# Altium project Temperature Monitor & Display.PrjPcb
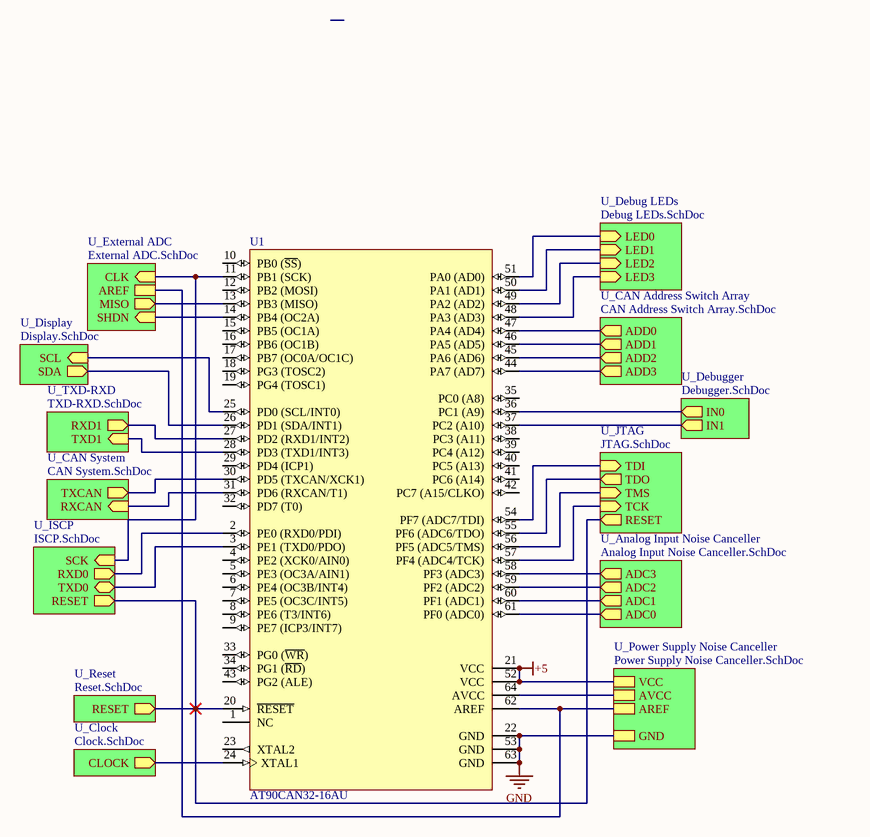
[diagram p0: Top Level.SchDoc]
14 sheets, 61 parts. Net scope: hierarchical (ports join the sheet entries above them; power ports are global).
Board file: Temperature Monitor & Display.PcbDoc
Sheets:
  Top Level.SchDoc
    U_Debug LEDs = Debug LEDs.SchDoc
    U_CAN Address Switch Array = CAN Address Switch Array.SchDoc
    U_JTAG = JTAG.SchDoc
    U_Power Supply Noise Canceller = Power Supply Noise Canceller.SchDoc
    U_Clock = Clock.SchDoc
    U_Reset = Reset.SchDoc
    U_CAN System = CAN System.SchDoc
    U_TXD-RXD = TXD-RXD.SchDoc
    U_ISCP = ISCP.SchDoc
    U_Analog Input Noise Canceller = Analog Input Noise Canceller.SchDoc
    U_Display = Display.SchDoc
    U_External ADC = External ADC.SchDoc
    U_Debugger = Debugger.SchDoc

## Sheet Top Level.SchDoc
size A

### Parts
U1  AT90CAN32-16AU  [64A_N]

### Sub-sheets
U_Analog Input Noise Canceller = Analog Input Noise Canceller.SchDoc: ADC0 (out), ADC1 (out), ADC2 (out), ADC3 (out)
U_CAN Address Switch Array = CAN Address Switch Array.SchDoc: ADD0 (out), ADD1 (out), ADD2 (out), ADD3 (out)
U_CAN System = CAN System.SchDoc: RXCAN (in), TXCAN (out)
U_Clock = Clock.SchDoc: CLOCK (out)
U_Debug LEDs = Debug LEDs.SchDoc: LED0 (in), LED1 (in), LED2 (in), LED3 (in)
U_Debugger = Debugger.SchDoc: IN0 (out), IN1 (out)
U_Display = Display.SchDoc: SCL (in), SDA (out)
U_External ADC = External ADC.SchDoc: AREF, CLK (in), SHDN (in), MISO (out)
U_ISCP = ISCP.SchDoc: SCK (in), TXD0 (bidir), RESET (out), RXD0 (out)
U_JTAG = JTAG.SchDoc: TDI (in), TDO (out), TCK (in), TMS (in), RESET (out)
U_Power Supply Noise Canceller = Power Supply Noise Canceller.SchDoc: VCC, AREF, GND, AVCC
U_Reset = Reset.SchDoc: RESET (out)
U_TXD-RXD = TXD-RXD.SchDoc: TXD1 (in), RXD1 (out)

### Nets
+5: U1.21(VCC) U1.52(VCC) ; sheet U_Power Supply Noise Canceller/VCC
GND: U1.22(GND) U1.53(GND) U1.63(GND) ; sheet U_Power Supply Noise Canceller/GND
NetC2_2: U1.62(AREF) ; sheet U_Power Supply Noise Canceller/AREF, sheet U_External ADC/AREF
NetC3_2: U1.64(AVCC) ; sheet U_Power Supply Noise Canceller/AVCC
NetC11_2: U1.61(PF0_(ADC0)) ; sheet U_Analog Input Noise Canceller/ADC0
NetC12_2: U1.60(PF1_(ADC1)) ; sheet U_Analog Input Noise Canceller/ADC1
NetC13_2: U1.59(PF2_(ADC2)) ; sheet U_Analog Input Noise Canceller/ADC2
NetC14_2: U1.58(PF3_(ADC3)) ; sheet U_Analog Input Noise Canceller/ADC3
NetCAN_2: U1.49(PA2_(AD2)) ; sheet U_Debug LEDs/LED2
NetDB_2: U1.50(PA1_(AD1)) ; sheet U_Debug LEDs/LED1
NetERR_2: U1.51(PA0_(AD0)) ; sheet U_Debug LEDs/LED0
NetJ2_1: U1.28(PD3_(TXD1/INT3)) ; sheet U_TXD-RXD/TXD1
NetJ2_2: U1.27(PD2_(RXD1/INT2)) ; sheet U_TXD-RXD/RXD1
NetJ3_1: U1.25(PD0_(SCL/INT0)) ; sheet U_Display/SCL
NetJ3_2: U1.26(PD1_(SDA/INT1)) ; sheet U_Display/SDA
NetP1_1: U1.57(PF4_(ADC4/TCK)) ; sheet U_JTAG/TCK
NetP1_3: U1.55(PF6_(ADC6/TDO)) ; sheet U_JTAG/TDO
NetP1_5: U1.56(PF5_(ADC5/TMS)) ; sheet U_JTAG/TMS
NetP1_6: U1.20(~{RESET}) ; sheet U_JTAG/RESET, sheet U_Reset/RESET, sheet U_ISCP/RESET
NetP1_9: U1.54(PF7_(ADC7/TDI)) ; sheet U_JTAG/TDI
NetP4_1: U1.2(PE0_(RXD0/PDI)) ; sheet U_ISCP/RXD0
NetP4_3: U1.11(PB1_(SCK)) ; sheet U_ISCP/SCK, sheet U_External ADC/CLK
NetP4_4: U1.3(PE1_(TXD0/PDO)) ; sheet U_ISCP/TXD0
NetPWR_2: U1.48(PA3_(AD3)) ; sheet U_Debug LEDs/LED3
NetR6_2: U1.47(PA4_(AD4)) ; sheet U_CAN Address Switch Array/ADD0
NetR7_2: U1.46(PA5_(AD5)) ; sheet U_CAN Address Switch Array/ADD1
NetR8_2: U1.45(PA6_(AD6)) ; sheet U_CAN Address Switch Array/ADD2
NetR9_2: U1.44(PA7_(AD7)) ; sheet U_CAN Address Switch Array/ADD3
NetR15_1: U1.36(PC1_(A9)) ; sheet U_Debugger/IN0
NetR16_2: U1.37(PC2_(A10)) ; sheet U_Debugger/IN1
NetU1_13: U1.13(PB3_(MISO)) ; sheet U_External ADC/MISO
NetU1_14: U1.14(PB4_(OC2A)) ; sheet U_External ADC/SHDN
NetU1_24: U1.24(XTAL1) ; sheet U_Clock/CLOCK
NetU1_30: U1.30(PD5_(TXCAN/XCK1)) ; sheet U_CAN System/TXCAN
NetU1_31: U1.31(PD6_(RXCAN/T1)) ; sheet U_CAN System/RXCAN

Not connected (* = marked no-connect by the designer): U1 1(NC) 4(PE2_(XCK0/AIN0)) 5(PE3_(OC3A/AIN1)) 6(PE4_(OC3B/INT4)) 7(PE5_(OC3C/INT5)) 8(PE6_(T3/INT6)) 9(PE7_(ICP3/INT7)) 10(PB0_(~{SS})) 12(PB2_(MOSI)) 15(PB5_(OC1A)) 16(PB6_(OC1B)) 17(PB7_(OC0A/OC1C)) 18(PG3_(TOSC2)) 19(PG4_(TOSC1)) 23(XTAL2) 29(PD4_(ICP1)) 32(PD7_(T0)) 33(PG0_(~{WR})) 34(PG1_(~{RD})) 35(PC0_(A8)) 38(PC3_(A11)) 39(PC4_(A12)) 40(PC5_(A13)) 41(PC6_(A14)) 42(PC7_(A15/CLKO)) 43(PG2_(ALE))

### Library data of the parts
U1 = CMP-0096-00116-2: 8-bit AVR Microcontroller, 32KB Flash and CAN Controller, 53 GPIO pins, Industrial Grade (-40° to +85°C), 64-pin LQFP, Green; RevisionNote: PackageVersion updated. URLs added.; DatasheetVersion: revH, Aug-2008; PackageReference: 64A; ComponentLink3URL: http://www.atmel.com/dyn/resources/prod_documents/7679S.pdf; ComponentLink3Description: AT90CAN32/64/128 Summary; ComponentLink2Description: AT90CAN32/64/128 Datasheet; ComponentLink2URL: http://www.atmel.com/dyn/resources/prod_documents/doc7679.pdf; ComponentLink1URL: http://www.atmel.com/; PackageVersion: revC, Oct-2010; PackageDescription: 64-Pin Plastic Thin Profile Quad Flat Pack, 14 x 14 x 1.0 mm Body, 0.8 mm Pitch (TQFP); Code_JEDEC: MS-026-AEB; ComponentLink1Description: Manufacturer URL

## Sheet Debug LEDs.SchDoc
size A
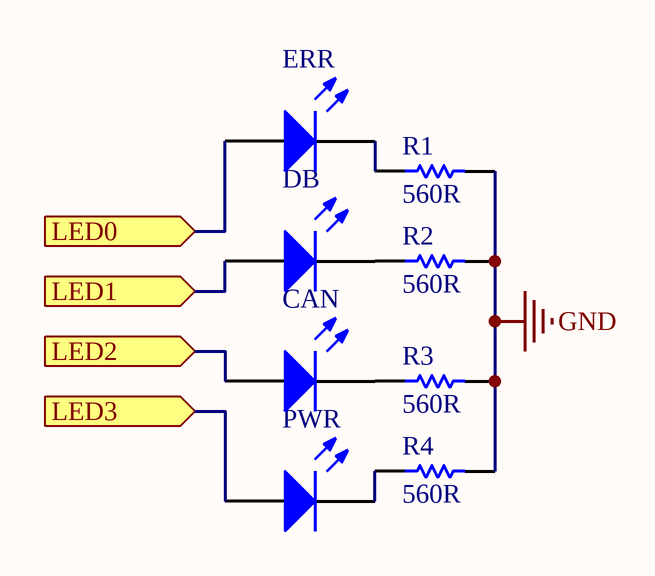
[diagram p1: Debug LEDs.SchDoc]

### Parts
CAN  150080BS75000  [0805_A]  (value not drawn)
DB  150080GS75000  [0805_A]  (value not drawn)
ERR  150080RS75000  [0805_A]  (value not drawn)
PWR  150080YS75000  [0805_A]  (value not drawn)
R1  560R  [RESC0805(2012)_M]
R2  560R  [RESC0805(2012)_M]
R3  560R  [RESC0805(2012)_M]
R4  560R  [RESC0805(2012)_M]

### Ports
LED0 (in), LED1 (in), LED2 (in), LED3 (in)

### Nets
GND: R1.2 R2.2 R3.2 R4.2
NetCAN_1: CAN.1(K) R3.1
NetCAN_2: CAN.2(A) ; port LED2
NetDB_1: DB.1(K) R2.1
NetDB_2: DB.2(A) ; port LED1
NetERR_1: ERR.1(K) R1.1
NetERR_2: ERR.2(A) ; port LED0
NetPWR_1: PWR.1(K) R4.1
NetPWR_2: PWR.2(A) ; port LED3

### Library data of the parts
CAN = CMP-1426-00008-1: SMD mono-color Chip LED, WL-SMCW, Blue; Manufacturer: Wuerth Elektronik; Color: Blue; ComponentLink2URL: http://katalog.we-online.com/led/datasheet/150080BS75000.pdf; ComponentLink1URL: http://www.we-online.com; ComponentLink2Description: Datasheet; PackageReference: 0805_A; ComponentLink1Description: Manufacturer URL; PartNumber: 150080BS75000
DB = CMP-1426-00007-1: SMD mono-color Chip LED, WL-SMCW, Green; Manufacturer: Wuerth Elektronik; PackageReference: 0805_A; Color: Green; PartNumber: 150080GS75000; ComponentLink2URL: http://katalog.we-online.com/led/datasheet/150080GS75000.pdf; ComponentLink1URL: http://www.we-online.com; ComponentLink1Description: Manufacturer URL; ComponentLink2Description: Datasheet
ERR = CMP-1426-00011-1: SMD mono-color Chip LED, WL-SMCW, Red; Manufacturer: Wuerth Elektronik; Color: Red; PartNumber: 150080RS75000; PackageReference: 0805_A; ComponentLink2Description: Datasheet; ComponentLink1URL: http://www.we-online.com; ComponentLink1Description: Manufacturer URL; ComponentLink2URL: http://katalog.we-online.com/led/datasheet/150080RS75000.pdf
PWR = CMP-1426-00012-1: SMD mono-color Chip LED, WL-SMCW, Yellow; Manufacturer: Wuerth Elektronik; Color: Yellow; ComponentLink1URL: http://www.we-online.com; PackageReference: 0805_A; ComponentLink2URL: http://katalog.we-online.com/led/datasheet/150080YS75000.pdf; ComponentLink1Description: Manufacturer URL; ComponentLink2Description: Datasheet; PartNumber: 150080YS75000
R1-R4 = CMP-1013-00482-1: 560R 0.125W 1% 0805 (2012 Metric)  SMD; Value: 560.00 Ohm; Case-Metric: 2012; Case-EIA: 0805; Technology: SMT; Tolerance: 1 %; Power: 0.125 W

## Sheet CAN Address Switch Array.SchDoc
size A
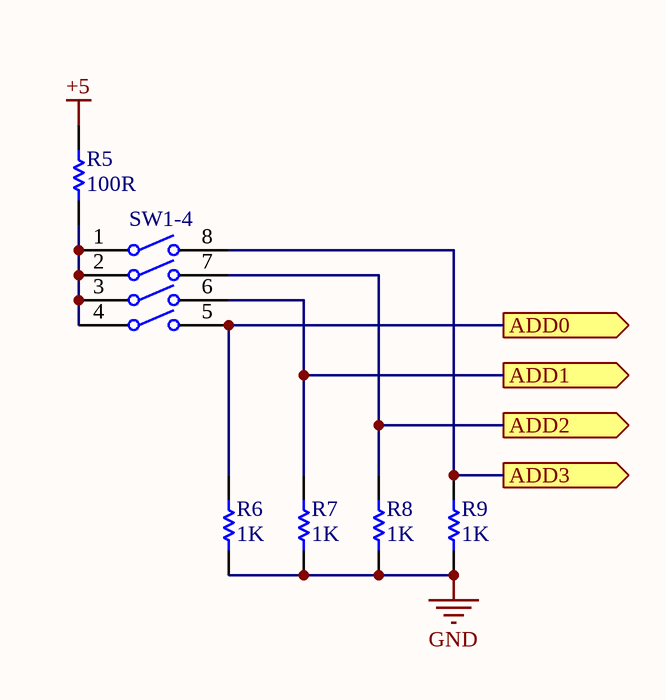
[diagram p2: CAN Address Switch Array.SchDoc]

### Parts
R5  100R  [RESC0805(2012)_L]
R6  1K  [RESC0805(2012)_M]
R7  1K  [RESC0805(2012)_M]
R8  1K  [RESC0805(2012)_M]
R9  1K  [RESC0805(2012)_M]
SW1-4  TDA04H0SB1  [CKCP-TDA04H0SB1R_V]  (value not drawn)

### Ports
ADD0 (out), ADD1 (out), ADD2 (out), ADD3 (out)

### Nets
+5: R5.2
GND: R6.1 R7.1 R8.1 R9.1
NetR5_1: R5.1 SW1-4.1 SW1-4.2 SW1-4.3 SW1-4.4
NetR6_2: R6.2 SW1-4.5 ; port ADD0
NetR7_2: R7.2 SW1-4.6 ; port ADD1
NetR8_2: R8.2 SW1-4.7 ; port ADD2
NetR9_2: R9.2 SW1-4.8 ; port ADD3

### Library data of the parts
R5 = CMP-1013-00397-1: 100R 0.125W 1% 0805 (2012 Metric)  SMD; Value: 100.00 Ohm; Case-Metric: 2012; Case-EIA: 0805; Technology: SMT; Power: 0.125 W; Tolerance: 1 %
R6-R9 = CMP-1013-00510-1: 1K 0.125W 1% 0805 (2012 Metric)  SMD; Case-Metric: 2012; Value: 1000.00 Ohm; Case-EIA: 0805; Tolerance: 1 %; Power: 0.125 W; Technology: SMT
SW1-4 = SMD Half-Pitch Dip Switch Array: Ultra-Miniature Surface Mount Half-Pitch DIP Switch, 25 mA, 24 V, -40 to 85 degC, 8-Pin SMD, RoHS, Tube; Contact Current Rating: 100 mA; Throw Configuration: SPST; Voltage Rating (DC): 24 V; Max Contact Resistance: 100 mohm; Max Current Rating: 25 mA; REACH SVHC: No SVHC; DatasheetVersion: 02/2016; Case\Package: DIP; Package Quantity: 70; Lead Pitch: 1.27 mm; Contact Plating: Gold; Packaging: Rail/Tube; Contact Finish: Gold; Mount: Surface Mount; Height: 2.3 mm; Contact Material: Copper; Max Operating Temperature: 85 degC; Max Voltage Rating (DC): 24 V; ComponentLink1URL: http://www.ck-components.com/media/1328/tda.pdf; PackageDescription: 8-Pin Surface Mount Device, Body 6.21 x 6.2 mm, Pitch 1.27 mm; Radiation Hardening: No; ComponentLink1Description: Datasheet; Current Rating: 100 mA; RoHSCompliant: true; PackageReference: TDA04H0SB1R; Min Operating Temperature: -40 degC; Pins: 4; Mounting Technology: Surface Mount; Length: 6.21 mm

## Sheet JTAG.SchDoc
size A
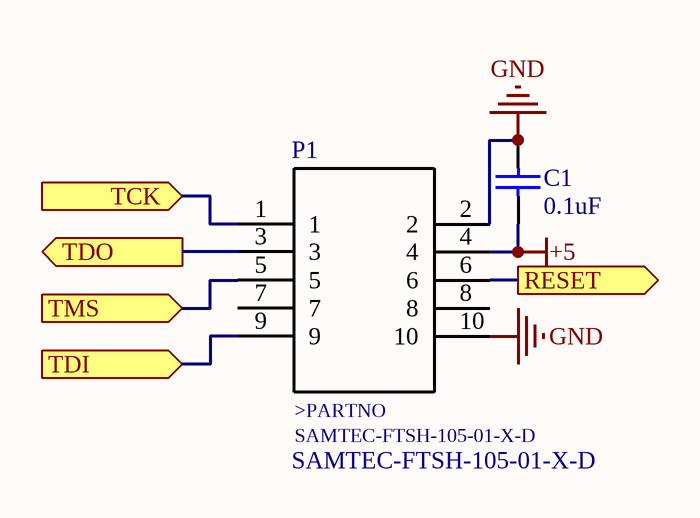
[diagram p3: JTAG.SchDoc]

### Parts
C1  0.1uF  [CAPC2013X94X50LL20T25]
P1  SAMTEC-FTSH-105-01-X-D  [SAMTEC-FTSH-105-01-X-D]

### Ports
RESET (out), TCK (in), TDI (in), TDO (out), TMS (in)

### Nets
+5: C1.1 P1.4
GND: C1.2 P1.2 P1.10
NetP1_1: P1.1 ; port TCK
NetP1_3: P1.3 ; port TDO
NetP1_5: P1.5 ; port TMS
NetP1_6: P1.6 ; port RESET
NetP1_9: P1.9 ; port TDI

Not connected (* = marked no-connect by the designer): P1 7 8

### Notes on the sheet
- (in symbol SAMTEC-FTSH-105-01-X-D) >PARTNO

### Library data of the parts
C1 = CMP-2000-05808-1: Chip Capacitor, 0.1 uF, +/- 5%, 50 V, -55 to 125 degC, 0805 (2012 Metric), RoHS, Tape and Reel; Case Width: 1.25mm; Case Length: 2.01mm; Case Height: 0.94mm; Brand: AVX; Type: StandardX7RMLCCs; Capacitance - nF: 100nF; Dissipation Factor DF: 2.5; Voltage Rating DC: 50V; Temperature Coefficient / Code: +/-15%; Capacitance - pF: 100000pF; Dielectric: X7R; Dimensions: 1.25mmWx2.01mmLx0.94mmH; Product: GeneralTypeMLCCs; Package Description: 2-Pin Surface Mount Device, Body 2.01 x 1.25 mm; Capacitance: 0.1uF; Package / Case: 0805(2012metric); Product Category: MultilayerCeramicCapacitorsMLCC-SMD/SMT; Case Code - mm: 2012; Packaging: Reel; Manufacturer URL: http://www.avx.com/; Operating Temperature Range: -55Cto+125C; Termination Style: SMD/SMT; Maximum Operating Temperature: +125C; Case Code - in: 0805; Minimum Operating Temperature: -55C; Factory Pack Quantity: 4000; RoHS: Details; Voltage Rating: 50V; Tolerance: 5%; Package Reference: 0805; Datasheet URL: http://www.farnell.com/datasheets/1679506.pdf; Manufacturer: AVX; Mounting Technology: SurfaceMount; Datasheet Version: 11/2012

## Sheet Power Supply Noise Canceller.SchDoc
size A
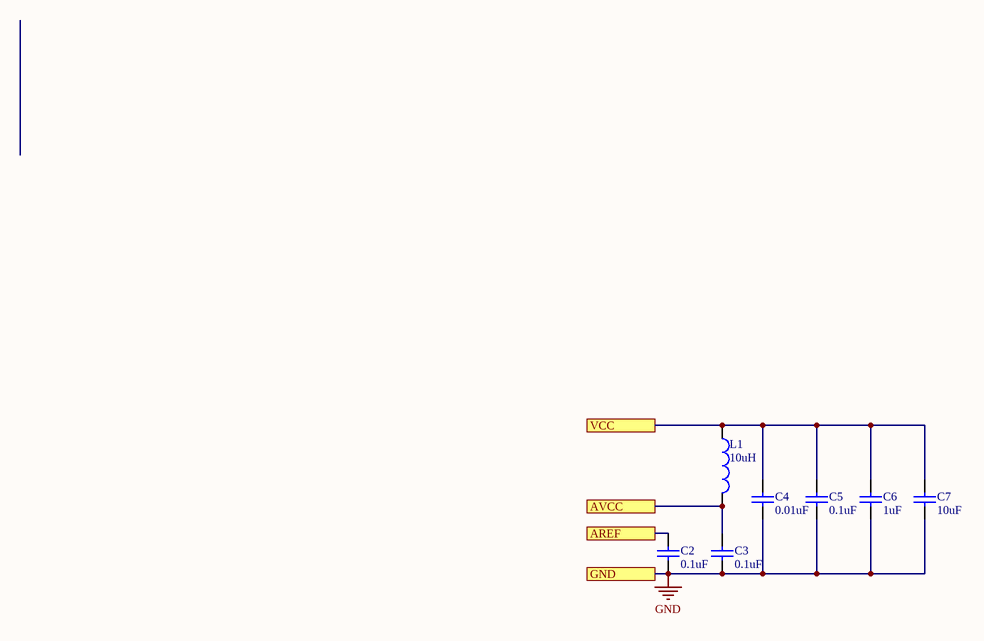
[diagram p4: Power Supply Noise Canceller.SchDoc]

### Parts
C2  0.1uF  [CAPC2013X94X50LL20T25]
C3  0.1uF  [CAPC2013X94X50LL20T25]
C4  0.01uF  [CAPC2013X88X50LL20T25]
C5  0.1uF  [CAPC2013X94X50LL20T25]
C6  1uF  [CAPC2013X145X50ML20T25]
C7  10uF  [CAPC2013X145X50LL20T20]
L1  10uH  [TDK-IND0805-125_V]

### Ports
AREF, AVCC, GND, VCC

### Nets
+5: C4.2 C5.2 C6.2 C7.2 L1.1 ; port VCC
GND: C2.1 C3.1 C4.1 C5.1 C6.1 C7.1 ; port GND
NetC2_2: C2.2 ; port AREF
NetC3_2: C3.2 L1.2 ; port AVCC

### Library data of the parts
C2 C3 C5 = CMP-2000-05808-1: as C1 on sheet JTAG; Dimensions: 1.25mmWx2.01mmLx0.94mmH; Product: GeneralTypeMLCCs; Package Description: 2-Pin Surface Mount Device, Body 2.01 x 1.25 mm; Capacitance: 0.1uF; Package / Case: 0805(2012metric); Product Category: MultilayerCeramicCapacitorsMLCC-SMD/SMT; Case Code - mm: 2012; Packaging: Reel; Manufacturer URL: http://www.avx.com/; Operating Temperature Range: -55Cto+125C; Termination Style: SMD/SMT; Maximum Operating Temperature: +125C; Case Code - in: 0805; Minimum Operating Temperature: -55C; Factory Pack Quantity: 4000; RoHS: Details; Voltage Rating: 50V; Tolerance: 5%; Package Reference: 0805; Datasheet URL: http://www.farnell.com/datasheets/1679506.pdf; Manufacturer: AVX; Mounting Technology: SurfaceMount; Datasheet Version: 11/2012
C4 = CMP-2000-05989-1: Chip Capacitor, 0.01 uF, +/- 10%, 50 V, -55 to 125 degC, 0805 (2012 Metric), RoHS, Tape and Reel; Manufacturer: Kemet; Voltage Rating: 50V; Dissipation Factor DF: 2.5; Type: SMDMLCCX7R6.3-250VDCCommericalGrade; Class: Class1; Capacitance - nF: 10nF; Dielectric: X7R; Case Width: 1.2mm; Case Length: 2mm; Temperature Coefficient / Code: +/-15%; Capacitance - pF: 10000pF; Case Height: 0.78mm; Datasheet Version: 10/2016; Dimensions: 1.2mmWx2mmLx0.78mmH; Case Code - mm: 2012; Datasheet URL: http://capacitoredge.kemet.com/capedge2/DataSheet/Datasheet-C0805C103K5RAC.pdf?pn=C0805C103K5RAC{BULK}; Capacitance: 0.01uF; Minimum Operating Temperature: -55C; Package / Case: 0805(2012metric); Mounting Technology: SurfaceMount; Package Reference: 0805; Product Category: MultilayerCeramicCapacitorsMLCC-SMD/SMT; Packaging: Reel; Brand: Kemet; Factory Pack Quantity: 4000; Voltage Rating DC: 50V; Operating Temperature Range: -55Cto+125C; Product: GeneralTypeMLCCs; RoHS: Details; Package Description: 2-Pin Surface Mount Device, Body 2 x 1.25 mm; Maximum Operating Temperature: +125C; Termination Style: SMD/SMT; Manufacturer URL: http://www.kemet.com/; Lead Spacing: 0.75mm; Case Code - in: 0805; Series: C0805C; Tolerance: 10%
C6 = CMP-2100-03605-1: Chip Capacitor, 1 uF, 25 V, 10%, -55 to 125 degC, 0805 (2012 Metric), RoHS, Tape and Reel; Manufacturer: Yageo; Voltage Rating: 25V; Dissipation Factor: 5%; Dielectric: X7R; Capacitance: 1uF; Length: 2mm; REACH SVHC: NoSVHC; Package Reference: 0805; Lead Free: LeadFree; Datasheet Version: Rev. 15, 10/2016; Width: 0.049inch; Thickness: 0.057inch; Case Code (Metric): 2012; Tolerance: 10%; Datasheet URL: http://www.yageo.com/documents/recent/UPY-GPHC_X7R_6.3V-to-50V_15.pdf; Number of Pins: 2; Radiation Hardening: No; Max Operating Temperature: 125degC; Depth: 1.25mm; Composition: Ceramic; Case Code (Imperial): 0805; Manufacturer URL: http://www.yageo.com/; Case/Package: 0805; Min Operating Temperature: -55degC; Mount: SurfaceMount; Package Description: 2-Pin Surface Mount Device, Body 2 x 1.25 mm; Height: 1.25mm; Termination: SMD/SMT; Packaging: TapeandReel; RoHSCompliant: True; Package Quantity: 3000; Voltage Rating (DC): 25V
C7 = CMP-2000-07390-1: Chip Capacitor, 10 uF, +/- 10%, 10 V, -55 to 85 degC, 0805 (2012 Metric), RoHS, Tape and Reel; Manufacturer: Vishay; Unit Weight: 0.000194oz; Voltage Rating DC: 10VDC; Brand: Vishay/Vitramon; Dielectric: X5R; Series: VJW1BC; Mounting Technology: SurfaceMount; Case Code - in: 0805; Capacitance: 10uF; Package Description: 2-Pin Surface Mount Device, Body 2.00 x 1.25 mm; Case Code - mm: 2012; Length: 2mm; Datasheet Version: 07/2016; Manufacturer URL: http://www.vishay.com/; Product Category: MultilayerCeramicCapacitorsMLCC-SMD/SMT; Maximum Operating Temperature: +85C; Datasheet URL: http://www.vishay.com/docs/28548/vjw1bcbascomseries.pdf; Factory Pack Quantity: 3000; Termination Style: SMD/SMT; Package / Case: 0805(2012metric); Minimum Operating Temperature: -55C; Package Reference: 0805; RoHS: True; Width: 1.25mm; Height: 1.25mm; Tolerance: 10%; Packaging: Reel
L1 = CMP-0266-00001-1: Multilayer Inductor, 10 uH, ±20%, 300 mOhm, 50MHz, 0805(2012); PartNumber: MLZ2012N100LT; DC Resistance: 0.3 Ohm; PackageReference: IND0805-125; ComponentLink1URL: http://www.global.tdk.com/; DatasheetVersion: 05/2013; ComponentLink2Description: Datasheet; ComponentLink1Description: Manufacturer URL; Mounting Technology: Suface Mount; ComponentLink2URL: http://www.tdk.co.jp/tcfx01/c533_mlz.pdf; PackageDescription: 2-Pin SMT Inductor, 2 x 1.25 mm Body

## Sheet Clock.SchDoc
size A
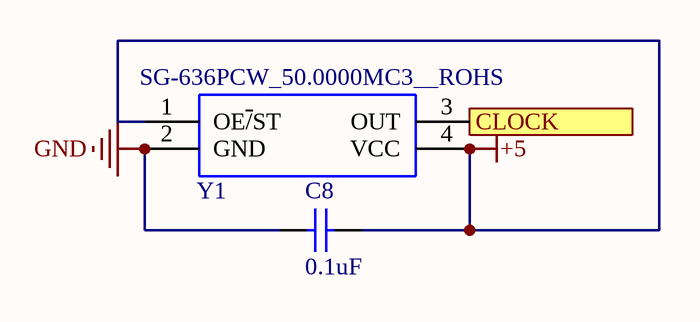
[diagram p5: Clock.SchDoc]

### Parts
C8  0.1uF  [CAPC2013X94X50LL20T25]
Y1  SG-636PCW_50.0000MC3__ROHS  [SG-636]

### Ports
CLOCK (out)

### Nets
+5: C8.1 Y1.1(OE~{/}ST) Y1.4(VCC)
GND: C8.2 Y1.2(GND)
NetU1_24: Y1.3(OUT) ; port CLOCK

### Library data of the parts
C8 = CMP-2000-05808-1: as C1 on sheet JTAG; Dimensions: 1.25mmWx2.01mmLx0.94mmH; Product: GeneralTypeMLCCs; Package Description: 2-Pin Surface Mount Device, Body 2.01 x 1.25 mm; Capacitance: 0.1uF; Package / Case: 0805(2012metric); Product Category: MultilayerCeramicCapacitorsMLCC-SMD/SMT; Case Code - mm: 2012; Packaging: Reel; Manufacturer URL: http://www.avx.com/; Operating Temperature Range: -55Cto+125C; Termination Style: SMD/SMT; Maximum Operating Temperature: +125C; Case Code - in: 0805; Minimum Operating Temperature: -55C; Factory Pack Quantity: 4000; RoHS: Details; Voltage Rating: 50V; Tolerance: 5%; Package Reference: 0805; Datasheet URL: http://www.farnell.com/datasheets/1679506.pdf; Manufacturer: AVX; Mounting Technology: SurfaceMount; Datasheet Version: 11/2012
Y1 = SG-636: Standard Clock Oscillators 50MHz 3.3Volt 100ppm -20C +70C; Manufacturer_Name: Epson Timing; Manufacturer_Part_Number: SG-636PCW 50.0000MC3: ROHS; RS Part Number: *; RS Price/Stock: *; Arrow Part Number: SG-636PCW 50.0000MC3: ROHS; Arrow Price/Stock: *; Datasheet Link: http://www.mouser.com/ds/2/137/G-636PCE_en-1003252.pdf

## Sheet Reset.SchDoc
size A
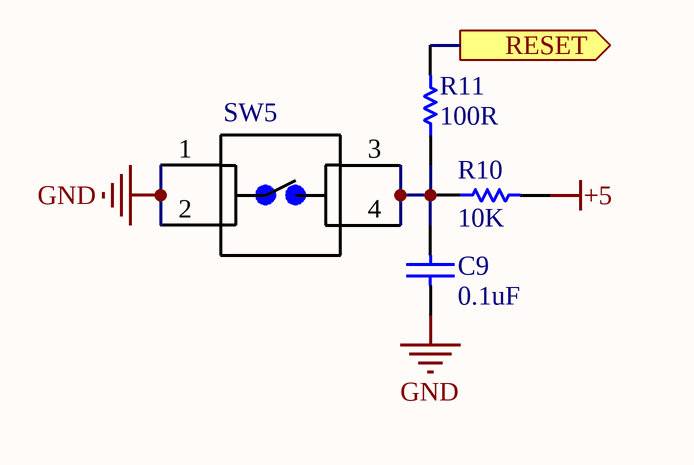
[diagram p6: Reset.SchDoc]

### Parts
C9  0.1uF  [CAPC2013X94X50LL20T25]
R10  10K  [RESC0805(2012)_L]
R11  100R  [RESC0805(2012)_L]
SW5  1825910-7  [Switch 6mm 24V (NO)]  (value not drawn)

### Ports
RESET (out)

### Nets
+5: R10.2
GND: C9.1 SW5.1 SW5.2
NetC9_2: C9.2 R10.1 R11.1 SW5.3 SW5.4
NetP1_6: R11.2 ; port RESET

### Library data of the parts
C9 = CMP-2000-05808-1: as C1 on sheet JTAG; Dimensions: 1.25mmWx2.01mmLx0.94mmH; Product: GeneralTypeMLCCs; Package Description: 2-Pin Surface Mount Device, Body 2.01 x 1.25 mm; Capacitance: 0.1uF; Package / Case: 0805(2012metric); Product Category: MultilayerCeramicCapacitorsMLCC-SMD/SMT; Case Code - mm: 2012; Packaging: Reel; Manufacturer URL: http://www.avx.com/; Operating Temperature Range: -55Cto+125C; Termination Style: SMD/SMT; Maximum Operating Temperature: +125C; Case Code - in: 0805; Minimum Operating Temperature: -55C; Factory Pack Quantity: 4000; RoHS: Details; Voltage Rating: 50V; Tolerance: 5%; Package Reference: 0805; Datasheet URL: http://www.farnell.com/datasheets/1679506.pdf; Manufacturer: AVX; Mounting Technology: SurfaceMount; Datasheet Version: 11/2012
R10 = CMP-1013-00624-1: 10K2 0.125W 1% 0805 (2012 Metric)  SMD; Case-Metric: 2012; Case-EIA: 0805; Value: 10200.00 Ohm; Technology: SMT; Tolerance: 1 %; Power: 0.125 W
R11 = CMP-1013-00397-1: as R5 on sheet CAN Address Switch Array; Technology: SMT; Power: 0.125 W; Tolerance: 1 %
SW5 = Switch 6mm 24V (NO): FSM4JAH=6MM TACT SWITCH, HIGH TEMP; MF: TE Connectivity; Contact_Current_Rating: 50 mA; Configuration_Pole-Throw: Single Pole - Single Throw; Package: None; Digi-Key_Part_Number: 450-1804-ND; Digi-Key_Purchase_URL: https://www.digikey.com/product-detail/en/te-connectivity-alcoswitch-switches/1825910-7/450-1804-ND/1731414?utm_source=snapeda&utm_medium=aggregator&utm_campaign=symbol; MP: 1825910-7; SnapEDA_Link: https://www.snapeda.com/parts/1825910-7/TE%20Connectivity%20ALCOSWITCH%20Switches/view-part/?ref=snap; EU_RoHS_Compliance: Compliant; TE_purchase_URL: https://www.te.com/usa-en/product-1825910-7.html?te_bu=Cor&te_type=disp&te_campaign=seda_glo_cor-seda-global-disp-prtnr-fy19-seda-model-bom-cta_sma-317_1&elqCampaignId=32493; Value: *

## Sheet CAN System.SchDoc
size A
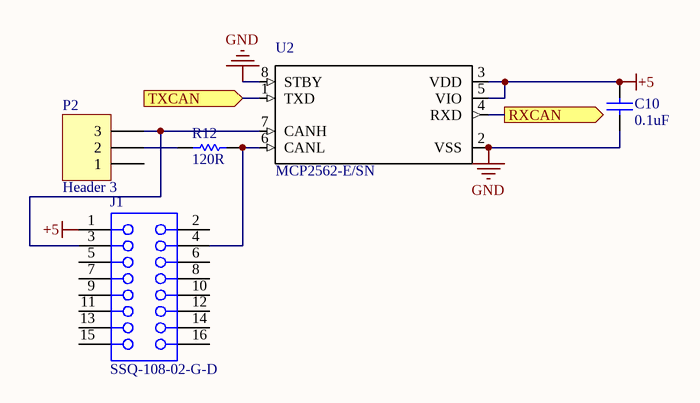
[diagram p7: CAN System.SchDoc]

### Parts
C10  0.1uF  [CAPC2013X94X50LL20T25]
J1  SSQ-108-02-G-D  [SMTC-SSQ-108-02-X-D]
P2  Header 3  [HDR1X3]
R12  120R  [RESC0805(2012)_N]
U2  MCP2562-E/SN  [SOIC127P600X175-8N]

### Ports
RXCAN (out), TXCAN (in)

### Nets
+5: C10.2 J1.1 U2.3(VDD) U2.5(VIO)
GND: C10.1 U2.2(VSS) U2.8(STBY)
NetJ1_3: J1.3 P2.3 U2.7(CANH)
NetJ1_4: J1.4 R12.2 U2.6(CANL)
NetP2_2: P2.2 R12.1
NetU1_30: U2.1(TXD) ; port TXCAN
NetU1_31: U2.4(RXD) ; port RXCAN

Not connected (* = marked no-connect by the designer): J1 2 5 6 7 8 9 10 11 12 13 14 15 16; P2 1

### Library data of the parts
C10 = CMP-2000-05808-1: as C1 on sheet JTAG; Dimensions: 1.25mmWx2.01mmLx0.94mmH; Product: GeneralTypeMLCCs; Package Description: 2-Pin Surface Mount Device, Body 2.01 x 1.25 mm; Capacitance: 0.1uF; Package / Case: 0805(2012metric); Product Category: MultilayerCeramicCapacitorsMLCC-SMD/SMT; Case Code - mm: 2012; Packaging: Reel; Manufacturer URL: http://www.avx.com/; Operating Temperature Range: -55Cto+125C; Termination Style: SMD/SMT; Maximum Operating Temperature: +125C; Case Code - in: 0805; Minimum Operating Temperature: -55C; Factory Pack Quantity: 4000; RoHS: Details; Voltage Rating: 50V; Tolerance: 5%; Package Reference: 0805; Datasheet URL: http://www.farnell.com/datasheets/1679506.pdf; Manufacturer: AVX; Mounting Technology: SurfaceMount; Datasheet Version: 11/2012
J1 = CMP-1023-00300-1: SQ Post Socket, Through-hole, Vertical, -55 to 125 degC, 2.54 mm Pitch, 16-Pin, Female, RoHS; Manufacturer: Samtec; Pitch: 2.54 mm; ComponentLink2URL: http://www.samtec.com/documents/webfiles/pdf/SSQ_TH.PDF; ComponentLink3Description: Package Specification; Mounting Technology: Through-hole; RoHS: True; PackageReference: SSQ-108-02-X-D; PartNumber: SSQ-108-02-G-D; Orientation: Vertical; ComponentLink1URL: http://www.samtec.com; DatasheetVersion: F-214; Temperature Range: -55 to 125 degC; PackageDescription: Assembly, Socket Strip .025[0.64] SQ Tail; PackageVersion: BD, 6/1987; ComponentLink2Description: Datasheet; ComponentLink1Description: Manufacturer URL; ComponentLink3URL: http://www.samtec.com/documents/webfiles/cpdf/SSQ-1XX-XX-XXX-X-XX-XXX-XX-X-MKT.pdf
P2 = Header 3: Header, 3-Pin; LatestRevisionDate: 17-Jul-2002; LatestRevisionNote: Re-released for DXP Platform.; Publisher: Altium Limited
R12 = 120R 5% 0805: 120R 0.125W 5% 0805 (2012 Metric)  SMD; Case-Metric: 2012; Value: 120.00 Ohm; Case-EIA: 0805; Tolerance: 5 %; Technology: SMT; Power: 0.125 W
U2 = MCP2562-E/SN: Microchip MCP2562-E/SN, CAN Transceiver 1MBps 1-channel IEC 61000-4-2, 8-Pin SOIC; Price: None; MF: Microchip; SnapEDA_Link: https://www.snapeda.com/parts/MCP2562-E/SN/Microchip/view-part/?ref=snap; MP: MCP2562-E/SN; Availability: Unavailable; Package: SO-8 Microchip; Value: *

## Sheet TXD-RXD.SchDoc
size A
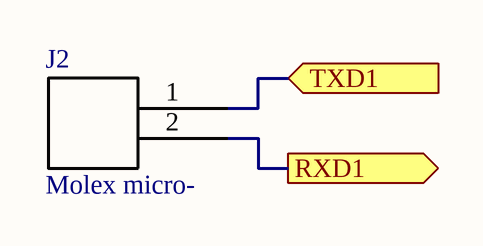
[diagram p8: TXD-RXD.SchDoc]

### Parts
J2  Molex micro-  [0430450227]

### Ports
RXD1 (out), TXD1 (in)

### Nets
NetJ2_1: J2.1 ; port TXD1
NetJ2_2: J2.2 ; port RXD1

### Library data of the parts
J2 = Molex micro-fit 2-pin: Molex micro-fit 3.0. Molex P/N 0430450227

## Sheet ISCP.SchDoc
size A
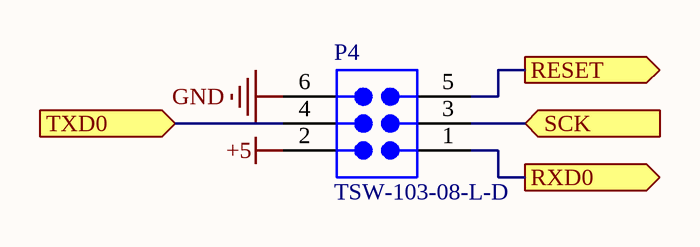
[diagram p9: ISCP.SchDoc]

### Parts
P4  TSW-103-08-L-D  [SMTC-TSW-103-08-X-D]

### Ports
RESET (out), RXD0 (out), SCK (in), TXD0 (in)

### Nets
+5: P4.2
GND: P4.6
NetP1_6: P4.5 ; port RESET
NetP4_1: P4.1 ; port RXD0
NetP4_3: P4.3 ; port SCK
NetP4_4: P4.4 ; port TXD0

### Library data of the parts
P4 = CMP-1024-00336-1: 0.025" SQ Post Header, Through-hole, Vertical, -55 to 125 degC, 2.54 mm Pitch, 6-Pin, Male, RoHS; Manufacturer: Samtec; Pitch: 2.54 mm; PackageVersion: DM, 8/1988; ComponentLink3Description: Package Specification; ComponentLink2Description: Datasheet; RoHS: True; ComponentLink1URL: http://www.samtec.com; PackageDescription: .025[0.64] SQ. Post Terminal Strip Assembly; PackageReference: TSW-103-08-X-D; Mounting Technology: Through-hole; DatasheetVersion: F-214; ComponentLink1Description: Manufacturer URL; Temperature Range: -55 to 125 degC; ComponentLink2URL: http://www.samtec.com/documents/webfiles/pdf/TSW_TH.PDF; ComponentLink3URL: http://www.samtec.com/documents/webfiles/cpdf/TSW-XXX-XX-XXX-X-XX-XXX-MKT.pdf; PartNumber: TSW-103-08-L-D; Orientation: Vertical

## Sheet Analog Input Noise Canceller.SchDoc
size A
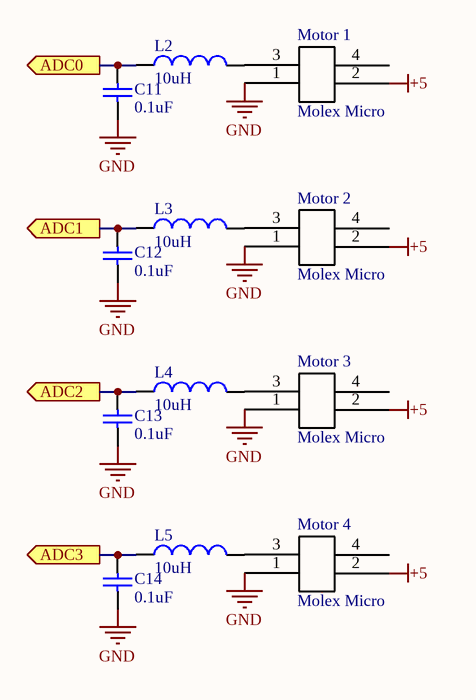
[diagram p10: Analog Input Noise Canceller.SchDoc]

### Parts
C11  0.1uF  [CAPC2013X94X50LL20T25]
C12  0.1uF  [CAPC2013X94X50LL20T25]
C13  0.1uF  [CAPC2013X94X50LL20T25]
C14  0.1uF  [CAPC2013X94X50LL20T25]
L2  10uH  [TDK-IND0805-125_V]
L3  10uH  [TDK-IND0805-125_V]
L4  10uH  [TDK-IND0805-125_V]
L5  10uH  [TDK-IND0805-125_V]
Motor_1  Molex Micro  [0430450427]
Motor_2  Molex Micro  [0430450427]
Motor_3  Molex Micro  [0430450427]
Motor_4  Molex Micro  [0430450427]

### Ports
ADC0 (out), ADC1 (out), ADC2 (out), ADC3 (out)

### Nets
+5: Motor_1.2 Motor_2.2 Motor_3.2 Motor_4.2
GND: C11.1 C12.1 C13.1 C14.1 Motor_1.1 Motor_2.1 Motor_3.1 Motor_4.1
NetC11_2: C11.2 L2.1 ; port ADC0
NetC12_2: C12.2 L3.1 ; port ADC1
NetC13_2: C13.2 L4.1 ; port ADC2
NetC14_2: C14.2 L5.1 ; port ADC3
NetL2_2: L2.2 Motor_1.3
NetL3_2: L3.2 Motor_2.3
NetL4_2: L4.2 Motor_3.3
NetL5_2: L5.2 Motor_4.3

Not connected (* = marked no-connect by the designer): Motor_1 4; Motor_2 4; Motor_3 4; Motor_4 4

### Library data of the parts
C11-C14 = CMP-2000-05808-1: as C1 on sheet JTAG; Dimensions: 1.25mmWx2.01mmLx0.94mmH; Product: GeneralTypeMLCCs; Package Description: 2-Pin Surface Mount Device, Body 2.01 x 1.25 mm; Capacitance: 0.1uF; Package / Case: 0805(2012metric); Product Category: MultilayerCeramicCapacitorsMLCC-SMD/SMT; Case Code - mm: 2012; Packaging: Reel; Manufacturer URL: http://www.avx.com/; Operating Temperature Range: -55Cto+125C; Termination Style: SMD/SMT; Maximum Operating Temperature: +125C; Case Code - in: 0805; Minimum Operating Temperature: -55C; Factory Pack Quantity: 4000; RoHS: Details; Voltage Rating: 50V; Tolerance: 5%; Package Reference: 0805; Datasheet URL: http://www.farnell.com/datasheets/1679506.pdf; Manufacturer: AVX; Mounting Technology: SurfaceMount; Datasheet Version: 11/2012
L2-L5 = CMP-0266-00001-1: as L1 on sheet Power Supply Noise Canceller; PackageReference: IND0805-125; ComponentLink1URL: http://www.global.tdk.com/; DatasheetVersion: 05/2013; ComponentLink2Description: Datasheet; ComponentLink1Description: Manufacturer URL; Mounting Technology: Suface Mount; ComponentLink2URL: http://www.tdk.co.jp/tcfx01/c533_mlz.pdf; PackageDescription: 2-Pin SMT Inductor, 2 x 1.25 mm Body
Motor_1-Motor_4 = Molex micro-fit 4-pin (dual row schematic): Molex micro-fit 3.0, P/N 0430450427

## Sheet Display.SchDoc
size A
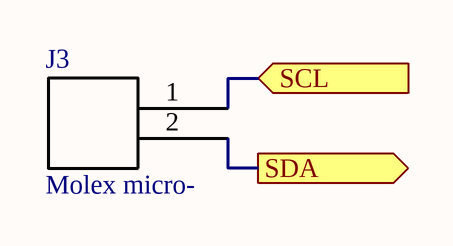
[diagram p11: Display.SchDoc]

### Parts
J3  Molex micro-  [0430450227]

### Ports
SCL (in), SDA (out)

### Nets
NetJ3_1: J3.1 ; port SCL
NetJ3_2: J3.2 ; port SDA

### Library data of the parts
J3 = Molex micro-fit 2-pin: as J2 on sheet TXD-RXD

## Sheet External ADC.SchDoc
size A
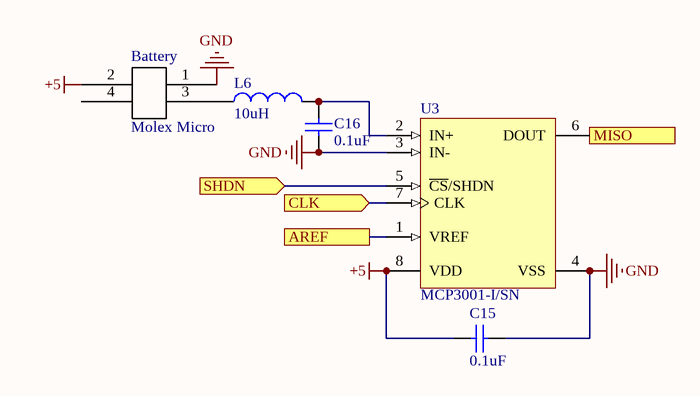
[diagram p12: External ADC.SchDoc]

### Parts
Battery  Molex Micro  [0430450427]
C15  0.1uF  [CAPC2013X94X50LL20T25]
C16  0.1uF  [CAPC2013X94X50LL20T25]
L6  10uH  [TDK-IND0805-125_V]
U3  MCP3001-I/SN  [SOIC-SN8_M]

### Ports
AREF, CLK (in), MISO (out), SHDN (in)

### Nets
+5: Battery.2 C15.2 U3.8(VDD)
GND: Battery.1 C15.1 C16.1 U3.3(IN-) U3.4(VSS)
NetBattery_3: Battery.3 L6.1
NetC2_2: U3.1(VREF) ; port AREF
NetC16_2: C16.2 L6.2 U3.2(IN+)
NetP4_3: U3.7(CLK) ; port CLK
NetU1_13: U3.6(DOUT) ; port MISO
NetU1_14: U3.5(~{CS}/SHDN) ; port SHDN

Not connected (* = marked no-connect by the designer): Battery 4

### Library data of the parts
Battery = Molex micro-fit 4-pin (dual row schematic): Molex micro-fit 3.0, P/N 0430450427
C15 C16 = CMP-2000-05808-1: as C1 on sheet JTAG; Dimensions: 1.25mmWx2.01mmLx0.94mmH; Product: GeneralTypeMLCCs; Package Description: 2-Pin Surface Mount Device, Body 2.01 x 1.25 mm; Capacitance: 0.1uF; Package / Case: 0805(2012metric); Product Category: MultilayerCeramicCapacitorsMLCC-SMD/SMT; Case Code - mm: 2012; Packaging: Reel; Manufacturer URL: http://www.avx.com/; Operating Temperature Range: -55Cto+125C; Termination Style: SMD/SMT; Maximum Operating Temperature: +125C; Case Code - in: 0805; Minimum Operating Temperature: -55C; Factory Pack Quantity: 4000; RoHS: Details; Voltage Rating: 50V; Tolerance: 5%; Package Reference: 0805; Datasheet URL: http://www.farnell.com/datasheets/1679506.pdf; Manufacturer: AVX; Mounting Technology: SurfaceMount; Datasheet Version: 11/2012
L6 = CMP-0266-00001-1: as L1 on sheet Power Supply Noise Canceller; PackageReference: IND0805-125; ComponentLink1URL: http://www.global.tdk.com/; DatasheetVersion: 05/2013; ComponentLink2Description: Datasheet; ComponentLink1Description: Manufacturer URL; Mounting Technology: Suface Mount; ComponentLink2URL: http://www.tdk.co.jp/tcfx01/c533_mlz.pdf; PackageDescription: 2-Pin SMT Inductor, 2 x 1.25 mm Body
U3 = CMP-0188-00515-1: 2.7V 10-Bit A/D Converter with SPI Serial Interface, 8-Pin SOIC 150mil, Industrial Temperature; PackageReference: SOIC-SN8; DatasheetVersion: revC, Jan-2007; Code_IPC: SOIC127P600-8; Code_JEDEC: MS-012; PackageDescription: 8-Lead Plastic Small Outline (SN) - Narrow, 3.90mm Body [SOIC]; PackageVersion: revBB, Aug-2009

## Sheet Debugger.SchDoc
size A
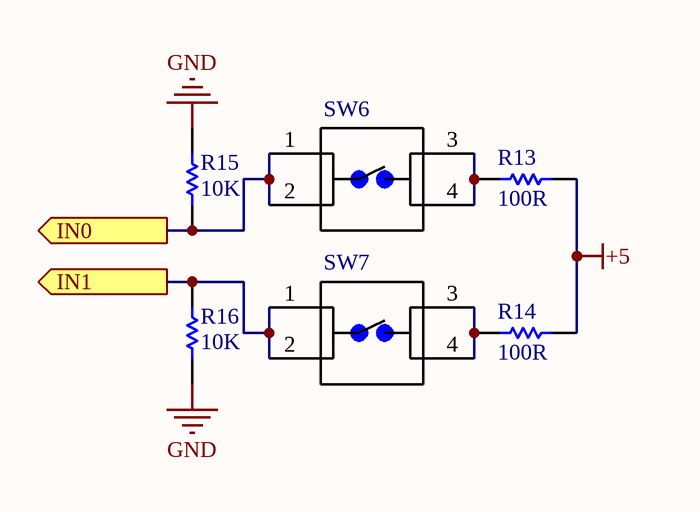
[diagram p13: Debugger.SchDoc]

### Parts
R13  100R  [RESC0805(2012)_L]
R14  100R  [RESC0805(2012)_L]
R15  10K  [RESC0805(2012)_L]
R16  10K  [RESC0805(2012)_L]
SW6  1825910-7  [Switch 6mm 24V (NO)]  (value not drawn)
SW7  1825910-7  [Switch 6mm 24V (NO)]  (value not drawn)

### Ports
IN0 (out), IN1 (out)

### Nets
+5: R13.1 R14.1
GND: R15.2 R16.1
NetR13_2: R13.2 SW6.3 SW6.4
NetR14_2: R14.2 SW7.3 SW7.4
NetR15_1: R15.1 SW6.1 SW6.2 ; port IN0
NetR16_2: R16.2 SW7.1 SW7.2 ; port IN1

### Library data of the parts
R13 R14 = CMP-1013-00397-1: as R5 on sheet CAN Address Switch Array; Technology: SMT; Power: 0.125 W; Tolerance: 1 %
R15 R16 = CMP-1013-00624-1: as R10 on sheet Reset; Technology: SMT; Tolerance: 1 %; Power: 0.125 W
SW6 SW7 = Switch 6mm 24V (NO): as SW5 on sheet Reset; Package: None; Digi-Key_Part_Number: 450-1804-ND; Digi-Key_Purchase_URL: https://www.digikey.com/product-detail/en/te-connectivity-alcoswitch-switches/1825910-7/450-1804-ND/1731414?utm_source=snapeda&utm_medium=aggregator&utm_campaign=symbol; MP: 1825910-7; SnapEDA_Link: https://www.snapeda.com/parts/1825910-7/TE%20Connectivity%20ALCOSWITCH%20Switches/view-part/?ref=snap; EU_RoHS_Compliance: Compliant; TE_purchase_URL: https://www.te.com/usa-en/product-1825910-7.html?te_bu=Cor&te_type=disp&te_campaign=seda_glo_cor-seda-global-disp-prtnr-fy19-seda-model-bom-cta_sma-317_1&elqCampaignId=32493; Value: *

## Nets that join several sheets
+5: Top Level (U1.21 U1.52), CAN Address Switch Array (R5.2), JTAG (C1.1 P1.4), Power Supply Noise Canceller (5 pins), Clock (C8.1 Y1.1 Y1.4), Reset (R10.2), CAN System (C10.2 J1.1 U2.3 U2.5), ISCP (P4.2), Analog Input Noise Canceller (Motor_1.2 Motor_2.2 Motor_3.2 Motor_4.2), External ADC (Battery.2 C15.2 U3.8), Debugger (R13.1 R14.1)
GND: Top Level (U1.22 U1.53 U1.63), Debug LEDs (R1.2 R2.2 R3.2 R4.2), CAN Address Switch Array (R6.1 R7.1 R8.1 R9.1), JTAG (C1.2 P1.2 P1.10), Power Supply Noise Canceller (6 pins), Clock (C8.2 Y1.2), Reset (C9.1 SW5.1 SW5.2), CAN System (C10.1 U2.2 U2.8), ISCP (P4.6), Analog Input Noise Canceller (8 pins), External ADC (5 pins), Debugger (R15.2 R16.1)
NetC2_2: Top Level (U1.62), Power Supply Noise Canceller (C2.2), External ADC (U3.1)
NetC3_2: Top Level (U1.64), Power Supply Noise Canceller (C3.2 L1.2)
NetC11_2: Top Level (U1.61), Analog Input Noise Canceller (C11.2 L2.1)
NetC12_2: Top Level (U1.60), Analog Input Noise Canceller (C12.2 L3.1)
NetC13_2: Top Level (U1.59), Analog Input Noise Canceller (C13.2 L4.1)
NetC14_2: Top Level (U1.58), Analog Input Noise Canceller (C14.2 L5.1)
NetCAN_2: Top Level (U1.49), Debug LEDs (CAN.2)
NetDB_2: Top Level (U1.50), Debug LEDs (DB.2)
NetERR_2: Top Level (U1.51), Debug LEDs (ERR.2)
NetJ2_1: Top Level (U1.28), TXD-RXD (J2.1)
NetJ2_2: Top Level (U1.27), TXD-RXD (J2.2)
NetJ3_1: Top Level (U1.25), Display (J3.1)
NetJ3_2: Top Level (U1.26), Display (J3.2)
NetP1_1: Top Level (U1.57), JTAG (P1.1)
NetP1_3: Top Level (U1.55), JTAG (P1.3)
NetP1_5: Top Level (U1.56), JTAG (P1.5)
NetP1_6: Top Level (U1.20), JTAG (P1.6), Reset (R11.2), ISCP (P4.5)
NetP1_9: Top Level (U1.54), JTAG (P1.9)
NetP4_1: Top Level (U1.2), ISCP (P4.1)
NetP4_3: Top Level (U1.11), ISCP (P4.3), External ADC (U3.7)
NetP4_4: Top Level (U1.3), ISCP (P4.4)
NetPWR_2: Top Level (U1.48), Debug LEDs (PWR.2)
NetR6_2: Top Level (U1.47), CAN Address Switch Array (R6.2 SW1-4.5)
NetR7_2: Top Level (U1.46), CAN Address Switch Array (R7.2 SW1-4.6)
NetR8_2: Top Level (U1.45), CAN Address Switch Array (R8.2 SW1-4.7)
NetR9_2: Top Level (U1.44), CAN Address Switch Array (R9.2 SW1-4.8)
NetR15_1: Top Level (U1.36), Debugger (R15.1 SW6.1 SW6.2)
NetR16_2: Top Level (U1.37), Debugger (R16.2 SW7.1 SW7.2)
NetU1_13: Top Level (U1.13), External ADC (U3.6)
NetU1_14: Top Level (U1.14), External ADC (U3.5)
NetU1_24: Top Level (U1.24), Clock (Y1.3)
NetU1_30: Top Level (U1.30), CAN System (U2.1)
NetU1_31: Top Level (U1.31), CAN System (U2.4)